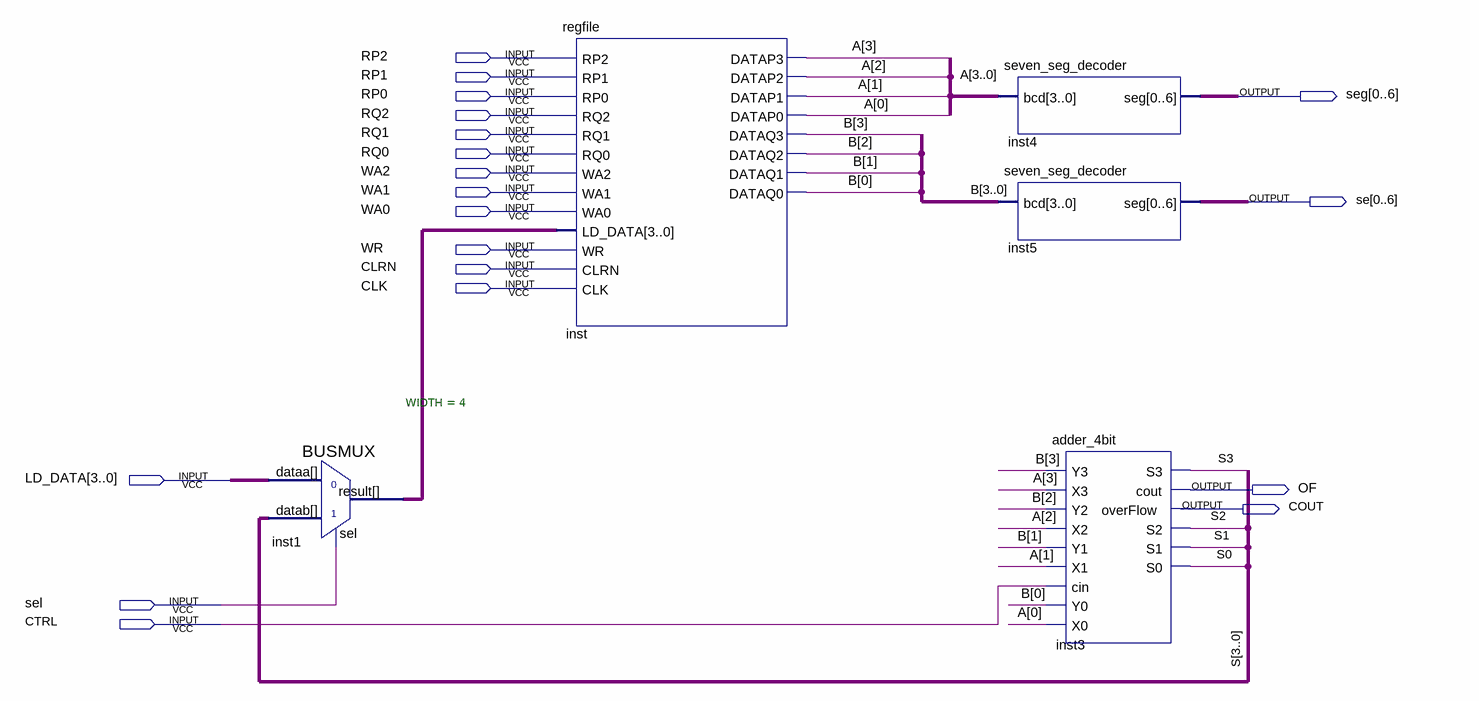
[diagram p0: schematic sheet]
// Quartus schematic register1.bdf as structural Verilog: 5 symbols, 19 pins
module register1 (
  input  RP2,
  input  RP1,
  input  RP0,
  input  RQ2,
  input  RQ1,
  input  RQ0,
  input  WA2,
  input  WA1,
  input  WA0,
  input  WR,
  input  CLRN,
  input  CLK,
  input  [3:0] LD_DATA,
  input  sel,
  input  CTRL,
  output [0:6] seg,
  output [0:6] se,
  output OF,
  output COUT
);

  wire [3:0] A, B, inst1_result, S;

  BUSMUX #(.WIDTH(4)) inst1 (.datab(S), .sel(sel), .dataa(LD_DATA), .result(inst1_result));
  regfile inst (
    .RP2(RP2), .RP1(RP1), .RP0(RP0), .RQ2(RQ2), .RQ1(RQ1), .RQ0(RQ0), .WA2(WA2), .WA1(WA1), .WA0(WA0),
    .LD_DATA(inst1_result), .WR(WR), .CLRN(CLRN), .CLK(CLK), .DATAP3(A[3]), .DATAP2(A[2]), .DATAP1(A[1]),
    .DATAP0(A[0]), .DATAQ3(B[3]), .DATAQ2(B[2]), .DATAQ1(B[1]), .DATAQ0(B[0]));
  seven_seg_decoder inst4 (.bcd(A), .seg(seg));
  seven_seg_decoder inst5 (.bcd(B), .seg(se));
  adder_4bit inst3 (
    .Y3(B[3]), .X3(A[3]), .Y2(B[2]), .X2(A[2]), .Y1(B[1]), .X1(A[1]), .cin(CTRL), .Y0(B[0]), .X0(A[0]),
    .S3(S[3]), .cout(OF), .overFlow(COUT), .S2(S[2]), .S1(S[1]), .S0(S[0]));
endmodule
